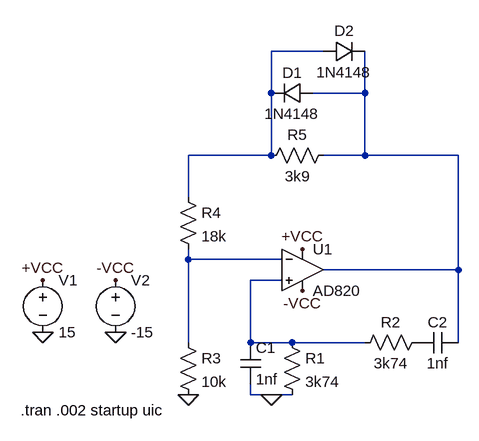
[diagram p0: schematic oscillator40.asc]
oscillator40.asc, the LTspice schematic file:
Version 4
SHEET 1 880 680
WIRE 464 -240 384 -240
WIRE 384 -176 384 -240
WIRE 528 -176 528 -240
WIRE 528 -176 448 -176
WIRE 384 -80 384 -176
WIRE 384 -80 256 -80
WIRE 528 -80 528 -176
WIRE 528 -80 464 -80
WIRE 672 -80 528 -80
WIRE 256 -16 256 -80
WIRE 256 80 256 64
WIRE 400 80 256 80
WIRE 672 96 672 -80
WIRE 672 96 464 96
WIRE 400 112 352 112
WIRE 256 208 256 80
WIRE 352 208 352 112
WIRE 416 208 352 208
WIRE 528 208 416 208
WIRE 672 208 672 96
WIRE 352 288 352 272
WIRE 384 288 352 288
WIRE 416 288 384 288
FLAG 32 192 0
FLAG 144 192 0
FLAG 32 112 +VCC
FLAG 144 112 -VCC
FLAG 432 128 -VCC
FLAG 432 64 +VCC
FLAG 384 288 0
FLAG 256 288 0
SYMBOL voltage 32 96 R0
WINDOW 123 0 0 Left 0
WINDOW 39 0 0 Left 0
SYMATTR InstName V1
SYMATTR Value 15
SYMBOL voltage 144 96 R0
WINDOW 123 0 0 Left 0
WINDOW 39 0 0 Left 0
SYMATTR InstName V2
SYMATTR Value -15
SYMBOL OpAmps\\AD820 432 32 R0
SYMATTR InstName U1
SYMBOL cap 336 208 R0
SYMATTR InstName C1
SYMATTR Value 1nf
SYMBOL res 400 192 R0
SYMATTR InstName R1
SYMATTR Value 3k74
SYMBOL res 624 192 R90
WINDOW 0 0 56 VBottom 2
WINDOW 3 32 56 VTop 2
SYMATTR InstName R2
SYMATTR Value 3k74
SYMBOL cap 672 192 R90
WINDOW 0 0 32 VBottom 2
WINDOW 3 32 32 VTop 2
SYMATTR InstName C2
SYMATTR Value 1nf
SYMBOL res 240 192 R0
SYMATTR InstName R3
SYMATTR Value 10k
SYMBOL res 240 -32 R0
SYMATTR InstName R4
SYMATTR Value 18k
SYMBOL res 480 -96 R90
WINDOW 0 0 56 VBottom 2
WINDOW 3 32 56 VTop 2
SYMATTR InstName R5
SYMATTR Value 3k9
SYMBOL diode 448 -192 R90
WINDOW 0 0 32 VBottom 2
WINDOW 3 32 32 VTop 2
SYMATTR InstName D1
SYMATTR Value 1N4148
SYMBOL diode 464 -224 R270
WINDOW 0 32 32 VTop 2
WINDOW 3 0 32 VBottom 2
SYMATTR InstName D2
SYMATTR Value 1N4148
TEXT -2 312 Left 2 !.tran .002 startup uic

The netlist it stands for:
* oscillator40.asc
V1 +VCC 0 15
V2 -VCC 0 -15
XU1 N004 N003 +VCC -VCC N002 AD820  ; pins In+ In- V+ V- OUT
C1 N004 0 1nf
R1 N004 0 3k74
R2 P001 N004 3k74
C2 N002 P001 1nf
R3 N003 0 10k
R4 N001 N003 18k
R5 N002 N001 3k9
D1 N002 N001 1N4148
D2 N001 N002 1N4148
.model D D
.lib standard.dio
.tran .002 startup uic
.backanno
.end